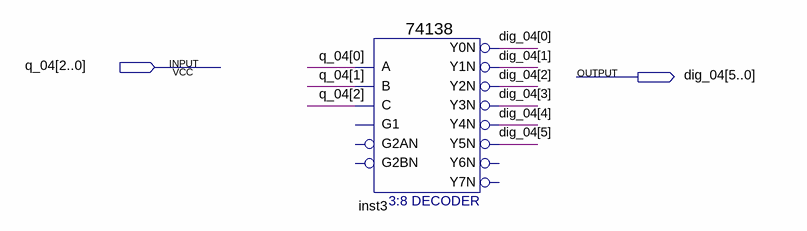
[diagram p0: schematic sheet]
// Quartus schematic dig_select.bdf as structural Verilog: 1 symbols, 2 pins
module dig_select (
  input  [2:0] q_04,
  output [5:0] dig_04
);

  \74138  inst3 (
    .A(q_04[0]), .B(q_04[1]), .C(q_04[2]), .Y0N(dig_04[0]), .Y1N(dig_04[1]), .Y2N(dig_04[2]),
    .Y3N(dig_04[3]), .Y4N(dig_04[4]), .Y5N(dig_04[5]));  // open: G1, G2AN, G2BN, Y6N, Y7N
endmodule
